# Altium schematic sheet voltageSupplies.SchDoc: voltageSupplies.SchDoc
size A; DocumentNumber: 4; SheetNumber: 3; SheetTotal: 4
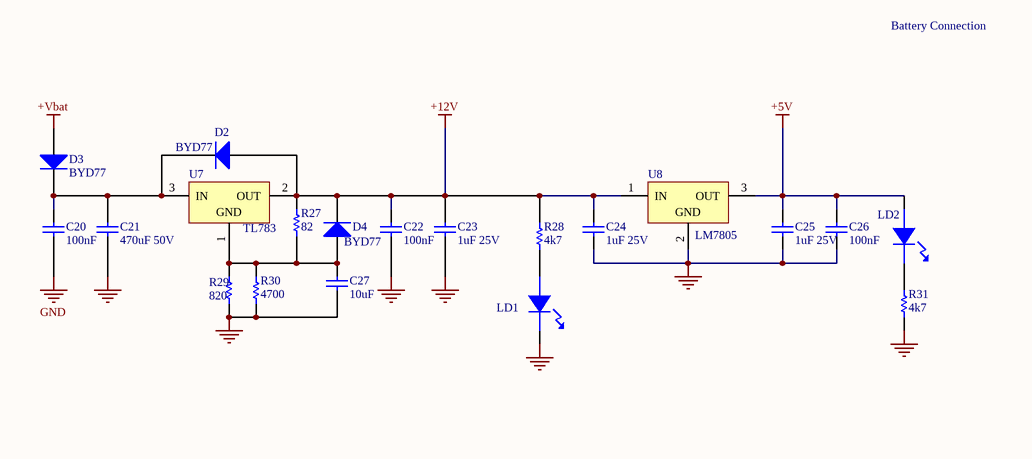
[diagram p0: voltageSupplies.SchDoc]

## Parts
C20  value 100nF  [C1210_M]  (hidden comment: Cap)
C21  value 470uF 50V  [CapEltr-Rad4.1-Dpp3.0]  (hidden comment: Cap)
C22  value 100nF  [C1210_M]  (hidden comment: Cap)
C23  value 1uF 25V  [CapEltr-Rad4.1-Dpp3.0]  (hidden comment: Cap)
C24  value 1uF 25V  [CapEltr-Rad4.1-Dpp3.0]  (hidden comment: Cap)
C25  value 1uF 25V  [CapEltr-Rad4.1-Dpp3.0]  (hidden comment: Cap)
C26  value 100nF  [C1210_M]  (hidden comment: Cap)
C27  value 10uF  [C1210_M]  (hidden comment: Cap)
D2  BYD77  [SOD87]
D3  value BYD77  [SOD87]  (hidden comment: Diode 1N4002)
D4  value BYD77  [SOD87]  (hidden comment: 1N4002)
LD1  RED  [6-0805_M]  (value not drawn)
LD2  RED  [6-0805_M]  (value not drawn)
R27  value 82  [6-0805_M]  (hidden comment: Res1)
R28  value 4k7  [6-0805_M]  (hidden comment: Res1)
R29  value 820  [6-0805_M]  (hidden comment: Res1)
R30  value 4700  [6-0805_M]  (hidden comment: Res1)
R31  value 4k7  [6-0805_M]  (hidden comment: Res1)
U7  TL783  [TO-220AB]
U8  LM7805  [TO-220AB]

## Nets
+5V: C25.2 C26.2 LD2.1 U8.3(OUT)
+12V: C22.2 C23.2 C24.2 D2.1(A) D4.2(K) R27.1 R28.2 U7.2(OUT) U8.1(IN)
+Vbat: D3.1(A)
GND: C20.1 C21.1 C22.1 C23.1 C24.1 C25.1 C26.1 C27.1 LD1.2 R29.1 R30.1 R31.1 U8.2(GND)
NetC20_2: C20.2 C21.2 D2.2(K) D3.2(K) U7.3(IN)
NetC27_2: C27.2 D4.1(A) R27.2 R29.2 R30.2 U7.1(ADJ)
NetLD1_1: LD1.1 R28.1
NetLD2_2: LD2.2 R31.2

## Notes on the sheet
- Battery Connection
- Pinagem compativel com LM317, modificando os resistores para:
  R3=240, R7=2k2, R6=33k
  tl783 -> (R102 // R103) = ((Vo/Vref) – 1) / R100
- (in symbol L7805ACV) GND

## Library data of the parts
C20-C27 = Cap: Capacitor; Published: 8-Jun-2000; LatestRevisionDate: 17-Jul-2002; LatestRevisionNote: Re-released for DXP Platform.; PackageReference: RAD-0.3; Publisher: Altium Limited; PackageDescription: Radial Cap, Thru-Hole; 2 Leads; 0.3 in Pin Spacing
D2-D4 = Diode 1N4002: 1 Amp General Purpose Rectifier; pin to pad: 1>A 2>K; Published: 8-Jun-2000; LatestRevisionDate: 17-Jul-2002; LatestRevisionNote: Re-released for DXP Platform.; DatasheetVersion: 1998; PackageVersion: Aug-1999; PackageReference: DO-41; Publisher: Altium Limited; PackageDescription: Diode, Axial; Body 5.2 x 2.7 mm (LxDia. max), Lead Dia. 0.86 mm (max); Code_JEDEC: DO-204-AL; ComponentLink1Description: Manufacturer Link; ComponentLink1URL: http://www.fairchildsemi.com/; ComponentLink2Description: Datasheet; ComponentLink2URL: http://www.fairchildsemi.com/ds/1N%2F1N4001.pdf
  D2: value: BYD77
LD1 LD2 = LED: Diodo Emissor de Luz; value: Led 0805 Vermelho
R27-R31 = Res1: Resistor; Published: 8-Jun-2000; LatestRevisionDate: 17-Jul-2002; LatestRevisionNote: Re-released for DXP Platform.; PackageReference: AXIAL-0.3; Publisher: Altium Limited; PackageDescription: Axial Device, Thru-Hole; 2 Leads; 0.3 in Pin Spacing
U7 = L7805ACV: Precision 1A Regulator; Note: Tab is connected to pin 3 (GND).; value: LT783; Published: 24-Aug-2001; LatestRevisionDate: 17-Jul-2002; LatestRevisionNote: Re-released for DXP Platform.; DatasheetVersion: Nov-1999; PackageVersion: Jun-1998; PackageReference: TO220ABN; Publisher: Altium Limited; PackageDescription: TO, Thru-Hole, Vertical, Heatsink Mounted; 3 In-Line Leads; Pitch 2.54 mm; Pin sequence 1, 3, 2; ComponentLink1Description: Manufacturer Link; ComponentLink1URL: http://www.st.com/; ComponentLink2Description: Datasheet; ComponentLink2URL: http://www.st.com/stonline/products/literature/ds/2144/l7805ab.pdf
U8 = µA7805CKC: Positive-Voltage Regulator; Note: Pin 2 is electrically connected to TAB.; Published: 15-Apr-2002; DatasheetVersion: Jul-1999; PackageVersion: Sep-1995; PackageReference: KC03; Publisher: Altium Limited; PackageDescription: TO, Thru-Hole, Vertical, Heatsink Mounted; 3 In-Line Leads; Pitch 2.54 mm; ComponentLink1Description: Manufacturer Link; ComponentLink1URL: http://www.ti.com/; ComponentLink2Description: Datasheet; ComponentLink2URL: http://www-s.ti.com/sc/ds/ua7805.pdf